# Altium schematic sheet 7 esc.SchDoc
size A4; DocumentNumber: 7; SheetNumber: 9; SheetTotal: 9
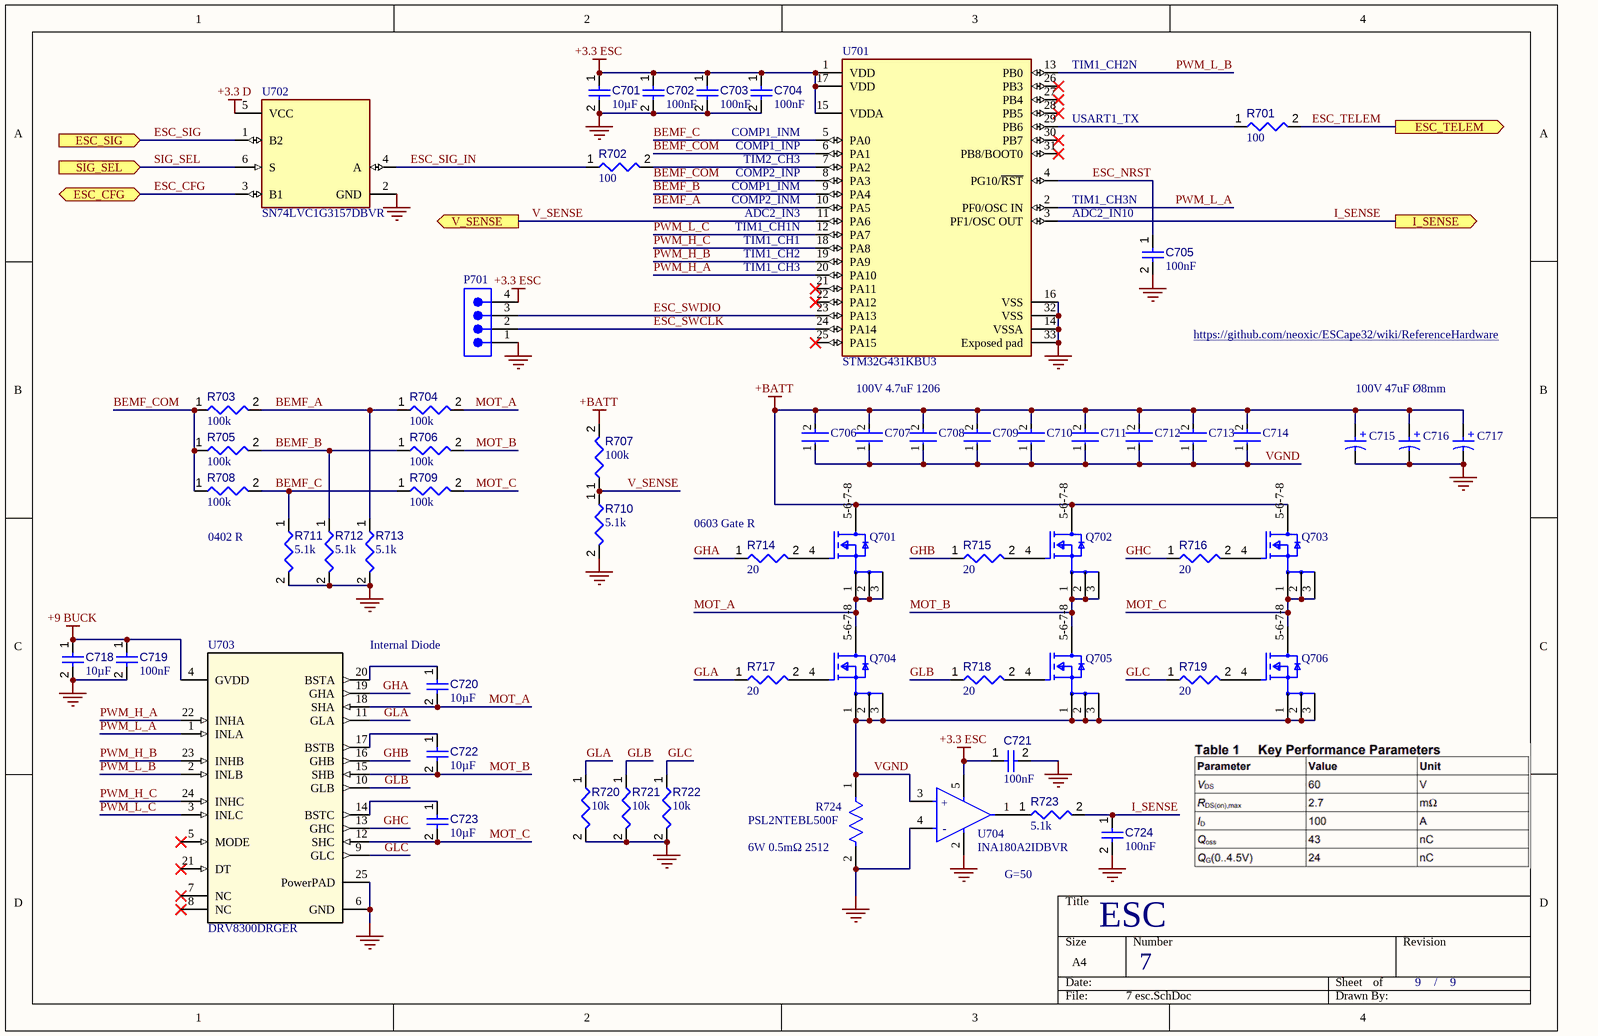
[diagram p0: 7 esc.SchDoc]

## Parts
C701  value 10µF  [CAPC0603(1608)100_L]  (hidden comment: Capacitor 10µF +/-20% 10V 0603)
C702  value 100nF  [CAPC0402(1005)60_L]  (hidden comment: Capacitor 100nF +/-20% 25V 0402)
C703  value 100nF  [CAPC0402(1005)60_L]  (hidden comment: Capacitor 100nF +/-20% 25V 0402)
C704  value 100nF  [CAPC0402(1005)60_L]  (hidden comment: Capacitor 100nF +/-20% 25V 0402)
C705  value 100nF  [CAPC0402(1005)60_L]  (hidden comment: Capacitor 100nF +/-20% 25V 0402)
C706  GRM31CZ72A475KE11L  [FP-GRM31C-0_3-e0_3_0_9-MFG]  (value not drawn)
C707  GRM31CZ72A475KE11L  [FP-GRM31C-0_3-e0_3_0_9-MFG]  (value not drawn)
C708  GRM31CZ72A475KE11L  [FP-GRM31C-0_3-e0_3_0_9-MFG]  (value not drawn)
C709  GRM31CZ72A475KE11L  [FP-GRM31C-0_3-e0_3_0_9-MFG]  (value not drawn)
C710  GRM31CZ72A475KE11L  [FP-GRM31C-0_3-e0_3_0_9-MFG]  (value not drawn)
C711  GRM31CZ72A475KE11L  [FP-GRM31C-0_3-e0_3_0_9-MFG]  (value not drawn)
C712  GRM31CZ72A475KE11L  [FP-GRM31C-0_3-e0_3_0_9-MFG]  (value not drawn)
C713  GRM31CZ72A475KE11L  [FP-GRM31C-0_3-e0_3_0_9-MFG]  (value not drawn)
C714  GRM31CZ72A475KE11L  [FP-GRM31C-0_3-e0_3_0_9-MFG]  (value not drawn)
C715  865230453006  [WCAP-AS5H_D8H10.5]  (value not drawn)
C716  865230453006  [WCAP-AS5H_D8H10.5]  (value not drawn)
C717  865230453006  [WCAP-AS5H_D8H10.5]  (value not drawn)
C718  value 10µF  [CAPC0603(1608)100_L]  (hidden comment: Capacitor 10µF +/-20% 10V 0603)
C719  value 100nF  [CAPC0402(1005)60_L]  (hidden comment: Capacitor 100nF +/-20% 25V 0402)
C720  value 10µF  [CAPC0603(1608)100_L]  (hidden comment: Capacitor 10µF +/-20% 10V 0603)
C721  value 100nF  [CAPC0402(1005)60_L]  (hidden comment: Capacitor 100nF +/-20% 25V 0402)
C722  value 10µF  [CAPC0603(1608)100_L]  (hidden comment: Capacitor 10µF +/-20% 10V 0603)
C723  value 10µF  [CAPC0603(1608)100_L]  (hidden comment: Capacitor 10µF +/-20% 10V 0603)
C724  value 100nF  [CAPC0402(1005)60_L]  (hidden comment: Capacitor 100nF +/-20% 25V 0402)
P701  61300411121  [61300411121]  (value not drawn)
Q701  BSC0702LSATMA1  [FP-PG-TDSON-8-MFG]  (value not drawn)
Q702  BSC0702LSATMA1  [FP-PG-TDSON-8-MFG]  (value not drawn)
Q703  BSC0702LSATMA1  [FP-PG-TDSON-8-MFG]  (value not drawn)
Q704  BSC0702LSATMA1  [FP-PG-TDSON-8-MFG]  (value not drawn)
Q705  BSC0702LSATMA1  [FP-PG-TDSON-8-MFG]  (value not drawn)
Q706  BSC0702LSATMA1  [FP-PG-TDSON-8-MFG]  (value not drawn)
R701  value 100  [RESC0402(1005)_L]  (hidden comment: Resistor 100R +/-1 % 0402 63 mW)
R702  value 100  [RESC0402(1005)_L]  (hidden comment: Resistor 100R +/-1 % 0402 63 mW)
R703  value 100k  [RESC0402(1005)_L]  (hidden comment: Resistor 100K +/-1 % 0402 63 mW)
R704  value 100k  [RESC0402(1005)_L]  (hidden comment: Resistor 100K +/-1 % 0402 63 mW)
R705  value 100k  [RESC0402(1005)_L]  (hidden comment: Resistor 100K +/-1 % 0402 63 mW)
R706  value 100k  [RESC0402(1005)_L]  (hidden comment: Resistor 100K +/-1 % 0402 63 mW)
R707  value 100k  [RESC0402(1005)_L]  (hidden comment: Resistor 100K +/-1 % 0402 63 mW)
R708  value 100k  [RESC0402(1005)_L]  (hidden comment: Resistor 100K +/-1 % 0402 63 mW)
R709  value 100k  [RESC0402(1005)_L]  (hidden comment: Resistor 100K +/-1 % 0402 63 mW)
R710  value 5.1k  [RESC0402(1005)_L]  (hidden comment: Resistor 5K1  +/-1 % 0402 63 mW)
R711  value 5.1k  [RESC0402(1005)_L]  (hidden comment: Resistor 5K1  +/-1 % 0402 63 mW)
R712  value 5.1k  [RESC0402(1005)_L]  (hidden comment: Resistor 5K1  +/-1 % 0402 63 mW)
R713  value 5.1k  [RESC0402(1005)_L]  (hidden comment: Resistor 5K1  +/-1 % 0402 63 mW)
R714  value 20  [RESC0603(1608)_L]  (hidden comment: Resistor 20R +/-5 % 0603 0.1 W)
R715  value 20  [RESC0603(1608)_L]  (hidden comment: Resistor 20R +/-5 % 0603 0.1 W)
R716  value 20  [RESC0603(1608)_L]  (hidden comment: Resistor 20R +/-5 % 0603 0.1 W)
R717  value 20  [RESC0603(1608)_L]  (hidden comment: Resistor 20R +/-5 % 0603 0.1 W)
R718  value 20  [RESC0603(1608)_L]  (hidden comment: Resistor 20R +/-5 % 0603 0.1 W)
R719  value 20  [RESC0603(1608)_L]  (hidden comment: Resistor 20R +/-5 % 0603 0.1 W)
R720  value 10k  [RESC0402(1005)_L]  (hidden comment: Resistor 10K  +/-1 % 0402 63 mW)
R721  value 10k  [RESC0402(1005)_L]  (hidden comment: Resistor 10K  +/-1 % 0402 63 mW)
R722  value 10k  [RESC0402(1005)_L]  (hidden comment: Resistor 10K  +/-1 % 0402 63 mW)
R723  value 5.1k  [RESC0402(1005)_L]  (hidden comment: Resistor 5K1  +/-1 % 0402 63 mW)
R724  PSL2NTEBL500F  [FP-PSL2NTEBL500F-MFG]
U701  STM32G431KBU3  [FP-UFQFPN32-A0B8-MFG]
U702  SN74LVC1G3157DBVR  [FP-DBV0006A-IPC_C]
U703  DRV8300DRGER  [RGE0024B-MFG]
U704  INA180A2IDBVR  [FP-DBV0005A-MFG]

## Ports
ESC_CFG (bidir), ESC_SIG (in), ESC_TELEM (out), I_SENSE (out), SIG_SEL (in), V_SENSE (out)

## Nets
+3.3 D: U702.5(VCC)
+3.3 ESC: C701.1 C702.1 C703.1 C704.1 C721.1 P701.4 U701.1(VDD) U701.15(VDDA) U701.17(VDD) U704.5(VS)
+9 BUCK: C718.1 C719.1 U703.4(GVDD)
+BATT: C706.2 C707.2 C708.2 C709.2 C710.2 C711.2 C712.2 C713.2 C714.2 C715.1(P) C716.1(P) C717.1(P) Q701.5-6-7-8(Drain) Q702.5-6-7-8(Drain) Q703.5-6-7-8(Drain) R707.2
GND: C701.2 C702.2 C703.2 C704.2 C705.2 C715.2(N) C716.2(N) C717.2(N) C718.2 C719.2 C721.2 C724.2 P701.1 R710.2 R711.2 R712.2 R713.2 R720.2 R721.2 R722.2 R724.2 U701.14(VSSA) U701.16(VSS) U701.32(VSS) U701.33(Exposed_pad) U702.2(GND) U703.6(GND) U703.25(PowerPAD) U704.2(GND) U704.4(IN-)
BEMF_A: R703.2 R704.1 R713.1 U701.10(PA5)
BEMF_B: R705.2 R706.1 R712.1 U701.9(PA4)
BEMF_C: R708.2 R709.1 R711.1 U701.5(PA0)
BEMF_COM: R703.1 R705.1 R708.1 U701.6(PA1) U701.8(PA3)
ESC_CFG: U702.3(B1) ; port ESC_CFG
ESC_NRST: C705.1 U701.4(PG10/~{RST})
ESC_SIG: U702.1(B2) ; port ESC_SIG
ESC_SIG_IN: R702.1 U702.4(A)
ESC_SWCLK: P701.2 U701.24(PA14)
ESC_SWDIO: P701.3 U701.23(PA13)
ESC_TELEM: R701.2 ; port ESC_TELEM
GHA: R714.1 U703.19(GHA)
GHB: R715.1 U703.16(GHB)
GHC: R716.1 U703.13(GHC)
GLA: R717.1 R720.1 U703.11(GLA)
GLB: R718.1 R721.1 U703.10(GLB)
GLC: R719.1 R722.1 U703.9(GLC)
I_SENSE: C724.1 R723.2 U701.3(PF1/OSC_OUT) ; port I_SENSE
MOT_A: C720.2 Q701.1(Source) Q701.2(Source) Q701.3(Source) Q704.5-6-7-8(Drain) R704.2 U703.18(SHA)
MOT_B: C722.2 Q702.1(Source) Q702.2(Source) Q702.3(Source) Q705.5-6-7-8(Drain) R706.2 U703.15(SHB)
MOT_C: C723.2 Q703.1(Source) Q703.2(Source) Q703.3(Source) Q706.5-6-7-8(Drain) R709.2 U703.12(SHC)
PWM_H_A: U701.20(PA10) U703.22(INHA)
PWM_H_B: U701.19(PA9) U703.23(INHB)
PWM_H_C: U701.18(PA8) U703.24(INHC)
PWM_L_A: U701.2(PF0/OSC_IN) U703.1(INLA)
PWM_L_B: U701.13(PB0) U703.2(INLB)
PWM_L_C: U701.12(PA7) U703.3(INLC)
SIG_SEL: U702.6(S) ; port SIG_SEL
V_SENSE: R707.1 R710.1 U701.11(PA6) ; port V_SENSE
VGND: C706.1 C707.1 C708.1 C709.1 C710.1 C711.1 C712.1 C713.1 C714.1 Q704.1(Source) Q704.2(Source) Q704.3(Source) Q705.1(Source) Q705.2(Source) Q705.3(Source) Q706.1(Source) Q706.2(Source) Q706.3(Source) R724.1 U704.3(IN+)
NetC720_1: C720.1 U703.20(BSTA)
NetC722_1: C722.1 U703.17(BSTB)
NetC723_1: C723.1 U703.14(BSTC)
NetQ701_4: Q701.4(Gate) R714.2
NetQ702_4: Q702.4(Gate) R715.2
NetQ703_4: Q703.4(Gate) R716.2
NetQ704_4: Q704.4(Gate) R717.2
NetQ705_4: Q705.4(Gate) R718.2
NetQ706_4: Q706.4(Gate) R719.2
NetR701_1: R701.1 U701.29(PB6)
NetR702_2: R702.2 U701.7(PA2)
NetR723_1: R723.1 U704.1(OUT)

Not connected (* = marked no-connect by the designer): U701 21(PA11)* 22(PA12)* 25(PA15)* 26(PB3)* 27(PB4)* 28(PB5)* 30(PB7)* 31(PB8/BOOT0)*; U703 5(MODE)* 7(NC)* 8(NC)* 21(DT)*

## Notes on the sheet
- (near U701) TIM1_CH2N
- COMP1_INM
- COMP1_INP
- TIM2_CH3
- (near U701) COMP2_INP
- (near U701) USART1_TX
- (near U701) TIM1_CH1N
- (near U701) TIM1_CH1
- (near U701) ADC2_IN3
- (near U701) COMP1_INM
- (near U701) COMP2_INM
- TIM1_CH3N
- ADC2_IN10
- (near U701) TIM1_CH2
- (near U701) TIM1_CH3
- https://github.com/neoxic/ESCape32/wiki/ReferenceHardware
- 100V 4.7uF 1206
- 100V 47uF Ø8mm
- 0402 R
- (near R714) 0603 Gate R
- Internal Diode
- (near R724) 6W 0.5mΩ 2512
- G=50
- ESC
- /
- (in symbol CMP-03913-53914685-1) +
- (in symbol CMP-04895-000287-1) +; -

## Library data of the parts
C701 C718 C720 C722 C723 = CMP-001-00075-4: Chip Capacitor, 10µF +/-20%, 10V, 0603, Thickness 1 mm; Tolerance: 10%; Voltage Rating: 10V; Max Operating Temperature: 85°C; Pins: 2; Case/Package: 0603; Mounting Technology: SMT; Min Operating Temperature: -55°C
C702-C705 C719 C721 C724 = CMP-001-00065-4: Chip Capacitor, 100nF +/-20%, 25V, 0402, Thickness 0.6 mm; Tolerance: 10%; Max Operating Temperature: 85°C; Min Operating Temperature: -55°C; Pins: 2; Voltage Rating: 25V; Mounting Technology: SMT; Case/Package: 0402
C706-C714 = CMP-06035-056253-1: Chip Multilayer Ceramic Capacitors for General Purpose, 1206, 4.7uF, X7R, 15%, 10%, 100V
C715-C717 = CMP-03913-53914685-1: 865230453006 WCAP-AS5H Aluminum Electrolytic Capacitors; Voltage Rating: 25V; Ripple Current (AC): 116mA; Life (Hours): 5000hours; Polarity: Polar; Insulation Resistance: 1MΩ; Tolerance: 20%; Leakage Current: 25µA; Capacitance: 100µF; Mount: Surface Mount; Height - Seated (Max): 10.4902mm; NexarPartId: 53914685; RoHS: Compliant; Packaging: Digi-Reel®; Min Operating Temperature: -40°C; REACH SVHC: Unknown; Diameter: 8mm; Width: 8.3mm; Case/Package: Radial; Length: 10.5mm; Max Operating Temperature: 105°C; Voltage Rating (DC): 25V; Ripple Current: 116mA; Height: 10.5mm
P701 = CMP-1502-01064-3: NexarPartId: 32855522; Operating Supply Voltage: 250V; Pitch: 2.54mm; Contact Resistance: 20mΩ; Number of Positions: 4; Current Rating: 3A; Connector Type: Male Pin; Gender: Male; Contact Plating: Gold; Height: 8.89mm; Lead Pitch: 2.54mm; Lead Free: Lead Free; Contact Mating Length: 5.9944mm; Number of Rows: 1; Termination: Solder; Packaging: Bulk; REACH SVHC: Unknown; Min Operating Temperature: -40°C; RoHS: Compliant; Number of Contacts: 4; Voltage Rating: 250V; Color: Black; Max Operating Temperature: 105°C; Contact Material: Copper; Mount: Through Hole; Orientation: Vertical; Number of Pins: 4
Q701-Q706 = CMP-00196-81703971-1: BSC0702LSATMA1 Transistor MOSFET N-CH 60V 100A 8-Pin TDSON T/R - Tape and Reel; Turn-Off Delay Time: 25ns; Max Junction Temperature (Tj): 150°C; Turn-On Delay Time: 7.7ns; Continuous Drain Current (ID): 23A; Number of Channels: 1; Power Dissipation: 2.5W; Gate to Source Voltage (Vgs): 20V; Drain to Source Resistance: 2.3mΩ; NexarPartId: 81703971; Drain to Source Breakdown Voltage: 60V; Max Operating Temperature: 150°C; Min Operating Temperature: -55°C; Drain to Source Voltage (Vdss): 60V; Height: 1mm
R701 R702 = CMP-009-00167-3: Chip Resistor, 100 Ohms, +/-1 %, 63 mW, -55 to 155 degC, 0402; Power: 63mW; Tolerance: 1%; Min Operating Temperature: -55°C; Case/Package: 0402; Pins: 2; Max Operating Temperature: 155°C
R703-R709 = CMP-009-00168-3: Chip Resistor, 100 kOhms, +/-1 %, 63 mW, -55 to 155 degC, 0402; Tolerance: 1%; Power: 63mW; Max Operating Temperature: 155°C; Min Operating Temperature: -55°C; Pins: 2; Case/Package: 0402
R710-R713 R723 = CMP-009-00158-3: Chip Resistor, 5.1 kOhms, +/-1 %, 63 mW, -55 to 155 degC, 0402; Power: 63mW; Tolerance: 1%; Max Operating Temperature: 155°C; Pins: 2; Min Operating Temperature: -55°C; Case/Package: 0402
R714-R719 = CMP-009-00183-1: Chip Resistor, 20 Ohms, +/-5 %, 0.1 W, -55 to 155 degC, 0603; Tolerance: 5%; Power: 100mW; Pins: 2; Max Operating Temperature: 155°C; Case/Package: 0603; Min Operating Temperature: -55°C
R720-R722 = CMP-009-00149-3: Chip Resistor, 10 kOhms, +/-1 %, 63 mW, -55 to 125 degC, 0402; Power: 63mW; Tolerance: 1%; Min Operating Temperature: -55°C; Case/Package: 0402; Max Operating Temperature: 155°C; Pins: 2
R724 = CMP-04015-070281-1: RES 500 UOHM 1% 8W NONSTANDARD; RoHS Compliant: Yes
U701 = CMP-12105-000119-1: IC MCU 32BIT 128KB FLSH 32UFQFPN; RoHS Compliant: Yes
U702 = CMP-0859-00203-4: IC SWITCH SPDT SOT23-6; Number of Outputs: 2; Propagation Delay: 300ps; On-State Resistance: 15R; Nominal Supply Current: 10uA; Number of Inputs: 1; Max Supply Voltage: 5.5V; Supply Type: Single; Low Level Output Current: 128mA; Bandwidth: 300MHz; Turn-Off Delay Time: 3.8ns; Turn-On Delay Time: 5.7ns; Operating Supply Current: 1uA; Min Supply Voltage: 1.65V; Polarity: Non-Inverting; Height: 1.3mm; Number of Bits: 1; Case/Package: SOT-23; REACH SVHC: No SVHC; High Level Output Current: 128mA; Weight: 0.000229oz; Max Supply Current: 10uA; Width: 1.75mm; Radiation Hardening: No; Supply Current: 10uA; Length: 3.05mm; Max Operating Temperature: 125°C; Min Operating Temperature: -40°C; Package Quantity: 3000; Number of Pins: 6; Termination: SMD/SMT; Series: 74LVC; Packaging: Tape and Reel; Lead Free: Lead Free; Contact Plating: Gold; Mount: Surface Mount; RoHS Compliant: Yes; Number of Channels: 1; Throw Configuration: SPDT
U703 = DRV8300DRGER: No Description Available; Mfr_Name: Texas Instruments; TYPE: TYPE; RefDes: RefDes
U704 = CMP-04895-000287-1: IC CURR SENSE 1 CIRCUIT SOT23-5; Operating Supply Current: 260uA; -3db Bandwidth: 350kHz; Slew Rate: 2V/µs; Number of Circuits: 1; Input Offset Voltage (Vos): 100uV; Input Bias Current: 100nA; Mount: Surface Mount; Max Operating Temperature: 125°C; Packaging: Tape and Reel; Min Operating Temperature: -40°C; Case/Package: SOT-23-5; RoHS Compliant: Yes